# EAGLE design PC1-ISA (EAGLE 9.3.0)
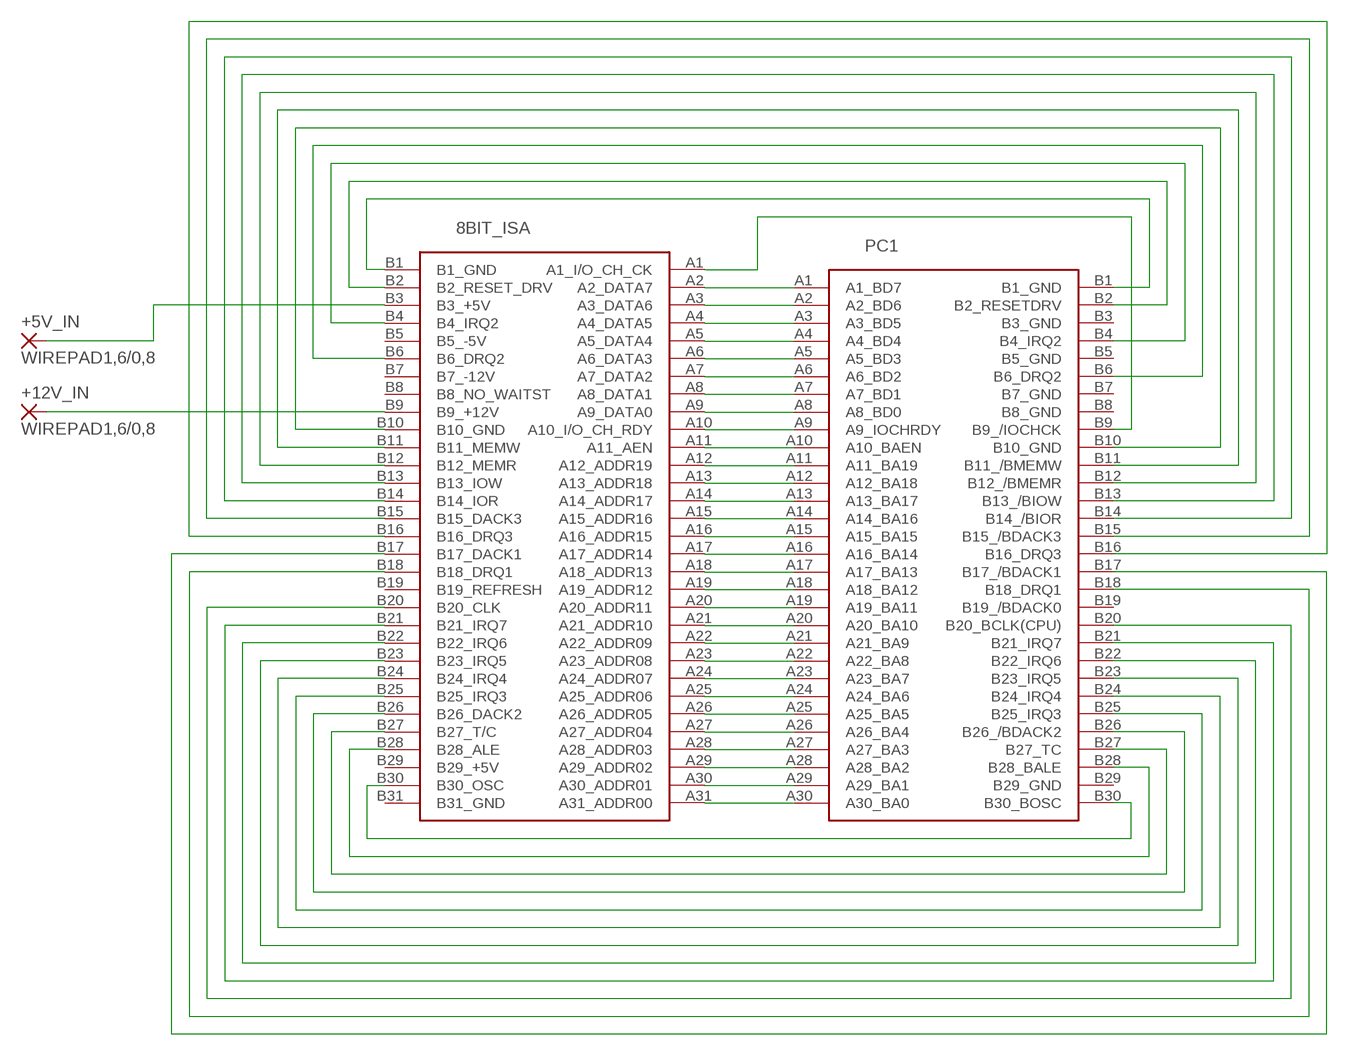
[diagram p0: schematic, sheet 1]

## Parts
8BIT_ISA  CARDEDGE_FEMALE_62PINS_8BITISA_STRAIGHT  [CARDEDGE_FEMALE_62PINS_8BITISA_STRAIGHT]
+5V_IN  WIREPAD1,6/0,8  [1,6/0,8]
+12V_IN  WIREPAD1,6/0,8  [1,6/0,8]
PC1  CARDEDGE_FEMALE_60PINS_PC1_ANGLEDLEFT  [CARDEDGE_FEMALE_60PINS_PC1_ANGLEDLEFT]

## Nets
N$1: 8BIT_ISA.A2(A2_DATA7) PC1.A1(A1_BD7)
N$2: 8BIT_ISA.A3(A3_DATA6) PC1.A2(A2_BD6)
N$3: 8BIT_ISA.A4(A4_DATA5) PC1.A3(A3_BD5)
N$4: 8BIT_ISA.A5(A5_DATA4) PC1.A4(A4_BD4)
N$5: 8BIT_ISA.A6(A6_DATA3) PC1.A5(A5_BD3)
N$6: 8BIT_ISA.A7(A7_DATA2) PC1.A6(A6_BD2)
N$7: 8BIT_ISA.A8(A8_DATA1) PC1.A7(A7_BD1)
N$8: 8BIT_ISA.A9(A9_DATA0) PC1.A8(A8_BD0)
N$9: 8BIT_ISA.A10(A10_I/O_CH_RDY) PC1.A9(A9_IOCHRDY)
N$10: 8BIT_ISA.A11(A11_AEN) PC1.A10(A10_BAEN)
N$11: 8BIT_ISA.A12(A12_ADDR19) PC1.A11(A11_BA19)
N$12: 8BIT_ISA.A13(A13_ADDR18) PC1.A12(A12_BA18)
N$13: 8BIT_ISA.A14(A14_ADDR17) PC1.A13(A13_BA17)
N$14: 8BIT_ISA.A15(A15_ADDR16) PC1.A14(A14_BA16)
N$15: 8BIT_ISA.A16(A16_ADDR15) PC1.A15(A15_BA15)
N$16: 8BIT_ISA.A17(A17_ADDR14) PC1.A16(A16_BA14)
N$17: 8BIT_ISA.A18(A18_ADDR13) PC1.A17(A17_BA13)
N$18: 8BIT_ISA.A19(A19_ADDR12) PC1.A18(A18_BA12)
N$19: 8BIT_ISA.A20(A20_ADDR11) PC1.A19(A19_BA11)
N$20: 8BIT_ISA.A21(A21_ADDR10) PC1.A20(A20_BA10)
N$21: 8BIT_ISA.A22(A22_ADDR09) PC1.A21(A21_BA9)
N$22: 8BIT_ISA.A23(A23_ADDR08) PC1.A22(A22_BA8)
N$23: 8BIT_ISA.A24(A24_ADDR07) PC1.A23(A23_BA7)
N$24: 8BIT_ISA.A25(A25_ADDR06) PC1.A24(A24_BA6)
N$25: 8BIT_ISA.A26(A26_ADDR05) PC1.A25(A25_BA5)
N$26: 8BIT_ISA.A27(A27_ADDR04) PC1.A26(A26_BA4)
N$27: 8BIT_ISA.A28(A28_ADDR03) PC1.A27(A27_BA3)
N$28: 8BIT_ISA.A29(A29_ADDR02) PC1.A28(A28_BA2)
N$29: 8BIT_ISA.A30(A30_ADDR01) PC1.A29(A29_BA1)
N$30: 8BIT_ISA.A31(A31_ADDR00) PC1.A30(A30_BA0)
N$31: 8BIT_ISA.A1(A1_I/O_CH_CK) PC1.B9(B9_/IOCHCK)
N$32: 8BIT_ISA.B1(B1_GND) PC1.B1(B1_GND)
N$33: 8BIT_ISA.B2(B2_RESET_DRV) PC1.B2(B2_RESETDRV)
N$34: 8BIT_ISA.B4(B4_IRQ2) PC1.B4(B4_IRQ2)
N$35: 8BIT_ISA.B6(B6_DRQ2) PC1.B6(B6_DRQ2)
N$36: 8BIT_ISA.B10(B10_GND) PC1.B10(B10_GND)
N$37: 8BIT_ISA.B11(B11_MEMW) PC1.B11(B11_/BMEMW)
N$38: 8BIT_ISA.B12(B12_MEMR) PC1.B12(B12_/BMEMR)
N$39: 8BIT_ISA.B30(B30_OSC) PC1.B30(B30_BOSC)
N$40: 8BIT_ISA.B28(B28_ALE) PC1.B28(B28_BALE)
N$41: 8BIT_ISA.B27(B27_T/C) PC1.B27(B27_TC)
N$42: 8BIT_ISA.B26(B26_DACK2) PC1.B26(B26_/BDACK2)
N$43: 8BIT_ISA.B25(B25_IRQ3) PC1.B25(B25_IRQ3)
N$44: 8BIT_ISA.B24(B24_IRQ4) PC1.B24(B24_IRQ4)
N$45: 8BIT_ISA.B23(B23_IRQ5) PC1.B23(B23_IRQ5)
N$46: 8BIT_ISA.B22(B22_IRQ6) PC1.B22(B22_IRQ6)
N$47: 8BIT_ISA.B21(B21_IRQ7) PC1.B21(B21_IRQ7)
N$48: 8BIT_ISA.B13(B13_IOW) PC1.B13(B13_/BIOW)
N$49: 8BIT_ISA.B14(B14_IOR) PC1.B14(B14_/BIOR)
N$50: 8BIT_ISA.B15(B15_DACK3) PC1.B15(B15_/BDACK3)
N$51: 8BIT_ISA.B16(B16_DRQ3) PC1.B16(B16_DRQ3)
N$52: 8BIT_ISA.B20(B20_CLK) PC1.B20(B20_BCLK(CPU))
N$53: 8BIT_ISA.B18(B18_DRQ1) PC1.B18(B18_DRQ1)
N$54: 8BIT_ISA.B17(B17_DACK1) PC1.B17(B17_/BDACK1)
N$55: 8BIT_ISA.B3(B3_+5V) +5V_IN.1(P)
N$56: 8BIT_ISA.B9(B9_+12V) +12V_IN.1(P)
Unconnected: 8BIT_ISA.B5(B5_-5V) 8BIT_ISA.B7(B7_-12V) 8BIT_ISA.B8(B8_NO_WAITST) 8BIT_ISA.B19(B19_REFRESH) 8BIT_ISA.B29(B29_+5V) 8BIT_ISA.B31(B31_GND) PC1.B3(B3_GND) PC1.B5(B5_GND) PC1.B7(B7_GND) PC1.B8(B8_GND) PC1.B19(B19_/BDACK0) PC1.B29(B29_GND)

## Library data of the parts
8BIT_ISA = Thomas:CARDEDGE_FEMALE_62PINS_8BITISA_STRAIGHT: 8bit ISA connector - for interfacing with an 8-bit ISA expansion card, i.e. this is the computer side. This is for a straight through-hole connector. Metal plate of the expansion card should go in the A1 and B1 end of the connector.
+5V_IN +12V_IN = wirepad:WIREPAD: Wire PAD connect wire on PCB
PC1 = Thomas:CARDEDGE_FEMALE_60PINS_PC1_ANGLEDLEFT: Commodore PC1 user port connector - for interfacing with the 60 pin "J12" card edge connector at the back of the PC1 computer. This is for an angled through-hole connector, pins pointing downwards when connected correctly to the computer.

## Board
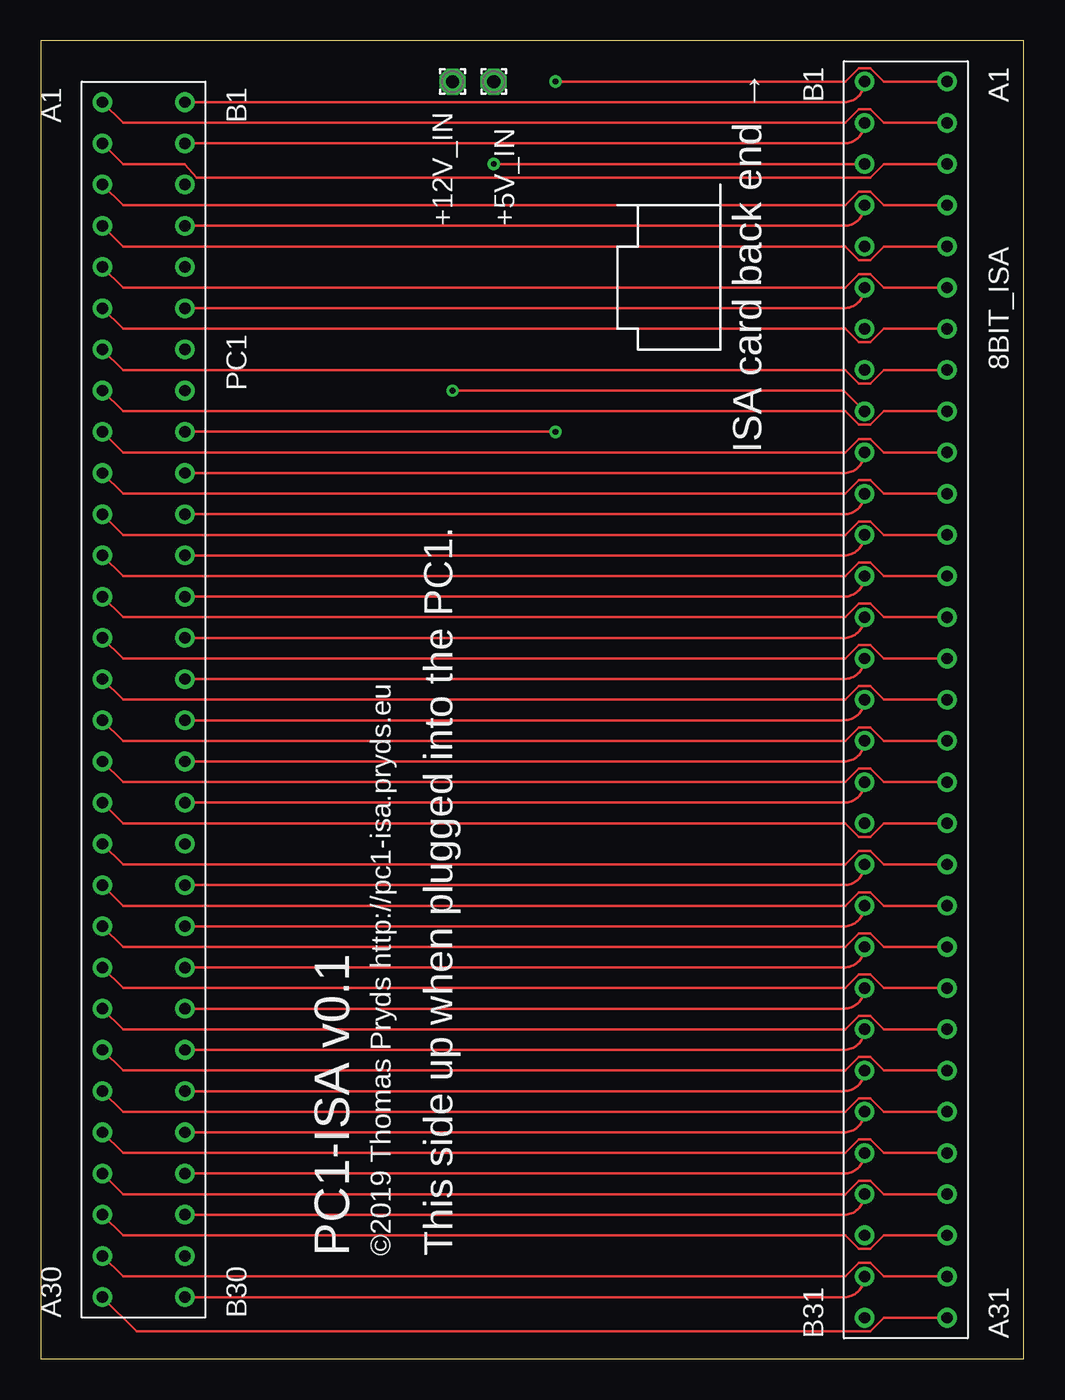
[diagram p1: board, top side]
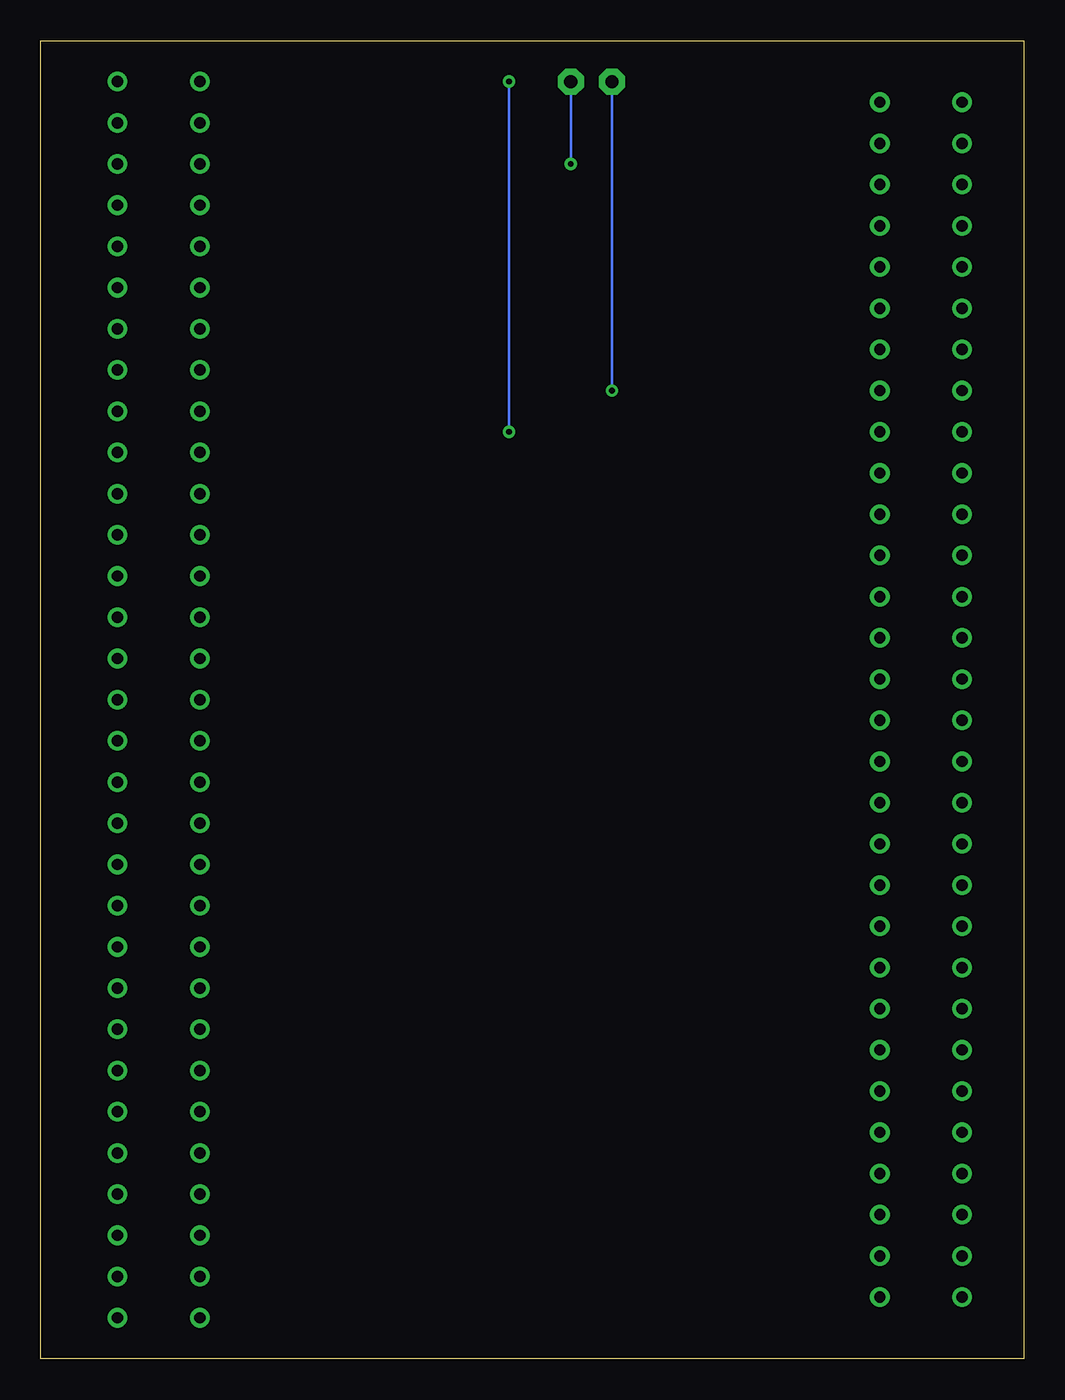
[diagram p2: board, bottom side, seen from below]

Size 60.63 x 81.27 mm. Coordinates in mm from the lower left corner, seen from the top.
Outline: 0,0 60.63,0 60.63,81.27 0,81.27 0,0
Copper layers (1*16): Top 0.035mm / dielectric 1.5mm / Bottom 0.035mm
Design rules "default": minimum track width 6mil, minimum drill 0.35mm, track to track 6mil, track to pad 6mil, pad to pad 6mil, via to via 6mil, smd to smd 6mil, copper to edge 40mil, drill to drill 6mil, minimum pad ring 10mil, minimum via ring 8mil, stop-mask expansion 4mil, vias tented up to drill 0mil, thermal gap 10mil

### Footprints (pad centres in the part's own frame; a part is rotated, then mirrored left to right if it is on the bottom)
CARDEDGE_FEMALE_62PINS_8BITISA_STRAIGHT = drill 0.7: A1 7.62,-1.27; A2 7.62,-3.81; A3 7.62,-6.35; A4 7.62,-8.89; A5 7.62,-11.43; A6 7.62,-13.97; A7 7.62,-16.51; A8 7.62,-19.05; A9 7.62,-21.59; A10 7.62,-24.13; A11 7.62,-26.67; A12 7.62,-29.21; A13 7.62,-31.75; A14 7.62,-34.29; A15 7.62,-36.83; A16 7.62,-39.37; A17 7.62,-41.91; A18 7.62,-44.45; A19 7.62,-46.99; A20 7.62,-49.53; A21 7.62,-52.07; A22 7.62,-54.61; A23 7.62,-57.15; A24 7.62,-59.69; A25 7.62,-62.23; A26 7.62,-64.77; A27 7.62,-67.31; A28 7.62,-69.85; A29 7.62,-72.39; A30 7.62,-74.93; A31 7.62,-77.47; B1 2.54,-1.27; B2 2.54,-3.81; B3 2.54,-6.35; B4 2.54,-8.89; B5 2.54,-11.43; B6 2.54,-13.97; B7 2.54,-16.51; B8 2.54,-19.05; B9 2.54,-21.59; B10 2.54,-24.13; B11 2.54,-26.67; B12 2.54,-29.21; B13 2.54,-31.75; B14 2.54,-34.29; B15 2.54,-36.83; B16 2.54,-39.37; B17 2.54,-41.91; B18 2.54,-44.45; B19 2.54,-46.99; B20 2.54,-49.53; B21 2.54,-52.07; B22 2.54,-54.61; B23 2.54,-57.15; B24 2.54,-59.69; B25 2.54,-62.23; B26 2.54,-64.77; B27 2.54,-67.31; B28 2.54,-69.85; B29 2.54,-72.39; B30 2.54,-74.93; B31 2.54,-77.47
1,6/0,8 = drill 0.813 pad 1.6 octagon: 1 0,0
CARDEDGE_FEMALE_60PINS_PC1_ANGLEDLEFT = drill 0.7: A1 2.54,-1.27; A2 2.54,-3.81; A3 2.54,-6.35; A4 2.54,-8.89; A5 2.54,-11.43; A6 2.54,-13.97; A7 2.54,-16.51; A8 2.54,-19.05; A9 2.54,-21.59; A10 2.54,-24.13; A11 2.54,-26.67; A12 2.54,-29.21; A13 2.54,-31.75; A14 2.54,-34.29; A15 2.54,-36.83; A16 2.54,-39.37; A17 2.54,-41.91; A18 2.54,-44.45; A19 2.54,-46.99; A20 2.54,-49.53; A21 2.54,-52.07; A22 2.54,-54.61; A23 2.54,-57.15; A24 2.54,-59.69; A25 2.54,-62.23; A26 2.54,-64.77; A27 2.54,-67.31; A28 2.54,-69.85; A29 2.54,-72.39; A30 2.54,-74.93; B1 7.62,-1.27; B2 7.62,-3.81; B3 7.62,-6.35; B4 7.62,-8.89; B5 7.62,-11.43; B6 7.62,-13.97; B7 7.62,-16.51; B8 7.62,-19.05; B9 7.62,-21.59; B10 7.62,-24.13; B11 7.62,-26.67; B12 7.62,-29.21; B13 7.62,-31.75; B14 7.62,-34.29; B15 7.62,-36.83; B16 7.62,-39.37; B17 7.62,-41.91; B18 7.62,-44.45; B19 7.62,-46.99; B20 7.62,-49.53; B21 7.62,-52.07; B22 7.62,-54.61; B23 7.62,-57.15; B24 7.62,-59.69; B25 7.62,-62.23; B26 7.62,-64.77; B27 7.62,-67.31; B28 7.62,-69.85; B29 7.62,-72.39; B30 7.62,-74.93

### Placement (x,y rotation side)
8BIT_ISA  48.26,80.01 0 top
+5V_IN  27.94,78.74 270 top
+12V_IN  25.4,78.74 90 top
PC1  1.27,78.74 0 top

### Tracks (layer width: path | path; a pad name or v marks a point on that pad's centre or on a via)
N$1
  Top 0.152: PC1.A1 5.08,76.2 49.62,76.2 50.45,77.03 51.15,77.03 51.98,76.2 8BIT_ISA.A2
N$2
  Top 0.152: PC1.A2 5.08,73.66 8.89,73.66 9.63,72.83 51.15,72.83 51.98,73.66 8BIT_ISA.A3
N$3
  Top 0.152: PC1.A3 5.08,71.12 49.62,71.12 50.45,71.95 51.15,71.95 51.98,71.12 8BIT_ISA.A4
N$4
  Top 0.152: PC1.A4 5.08,68.58 49.62,68.58 50.45,67.75 51.15,67.75 51.98,68.58 8BIT_ISA.A5
N$5
  Top 0.152: PC1.A5 5.08,66.04 49.62,66.04 50.45,66.87 51.15,66.87 51.98,66.04 8BIT_ISA.A6
N$6
  Top 0.152: PC1.A6 5.08,63.5 49.62,63.5 50.45,62.67 51.15,62.67 51.98,63.5 8BIT_ISA.A7
N$7
  Top 0.152: PC1.A7 5.08,60.96 49.62,60.96 50.45,60.13 51.15,60.13 51.98,60.96 8BIT_ISA.A8
N$8
  Top 0.152: PC1.A8 5.08,58.42 49.62,58.42 50.45,57.59 51.15,57.59 51.98,58.42 8BIT_ISA.A9
N$9
  Top 0.152: PC1.A9 5.08,55.88 49.62,55.88 50.45,56.71 51.15,56.71 51.98,55.88 8BIT_ISA.A10
N$10
  Top 0.152: PC1.A10 5.08,53.34 49.62,53.34 50.45,54.17 51.15,54.17 51.98,53.34 8BIT_ISA.A11
N$11
  Top 0.152: PC1.A11 5.08,50.8 49.62,50.8 50.45,51.63 51.15,51.63 51.98,50.8 8BIT_ISA.A12
N$12
  Top 0.152: PC1.A12 5.08,48.26 49.62,48.26 50.45,49.09 51.15,49.09 51.98,48.26 8BIT_ISA.A13
N$13
  Top 0.152: PC1.A13 5.08,45.72 49.62,45.72 50.45,46.55 51.15,46.55 51.98,45.72 8BIT_ISA.A14
N$14
  Top 0.152: PC1.A14 5.08,43.18 49.62,43.18 50.45,44.01 51.15,44.01 51.98,43.18 8BIT_ISA.A15
N$15
  Top 0.152: PC1.A15 5.08,40.64 49.62,40.64 50.45,41.47 51.15,41.47 51.98,40.64 8BIT_ISA.A16
N$16
  Top 0.152: PC1.A16 5.08,38.1 49.62,38.1 50.45,38.93 51.15,38.93 51.98,38.1 8BIT_ISA.A17
N$17
  Top 0.152: PC1.A17 5.08,35.56 49.62,35.56 50.45,36.39 51.15,36.39 51.98,35.56 8BIT_ISA.A18
N$18
  Top 0.152: PC1.A18 5.08,33.02 49.62,33.02 50.45,32.19 51.15,32.19 51.98,33.02 8BIT_ISA.A19
N$19
  Top 0.152: PC1.A19 5.08,30.48 49.62,30.48 50.45,31.31 51.15,31.31 51.98,30.48 8BIT_ISA.A20
N$20
  Top 0.152: PC1.A20 5.08,27.94 49.62,27.94 50.45,28.77 51.15,28.77 51.98,27.94 8BIT_ISA.A21
N$21
  Top 0.152: PC1.A21 5.08,25.4 49.62,25.4 50.45,26.23 51.15,26.23 51.98,25.4 8BIT_ISA.A22
N$22
  Top 0.152: PC1.A22 5.08,22.86 49.62,22.86 50.45,23.69 51.15,23.69 51.98,22.86 8BIT_ISA.A23
N$23
  Top 0.152: PC1.A23 5.08,20.32 49.62,20.32 50.45,21.15 51.15,21.15 51.98,20.32 8BIT_ISA.A24
N$24
  Top 0.152: PC1.A24 5.08,17.78 49.62,17.78 50.45,18.61 51.15,18.61 51.98,17.78 8BIT_ISA.A25
N$25
  Top 0.152: PC1.A25 5.08,15.24 49.62,15.24 50.45,16.07 51.15,16.07 51.98,15.24 8BIT_ISA.A26
N$26
  Top 0.152: PC1.A26 5.08,12.7 49.62,12.7 50.45,13.53 51.15,13.53 51.98,12.7 8BIT_ISA.A27
N$27
  Top 0.152: PC1.A27 5.08,10.16 49.62,10.16 50.45,10.99 51.15,10.99 51.98,10.16 8BIT_ISA.A28
N$28
  Top 0.152: PC1.A28 5.08,7.62 49.62,7.62 50.45,6.79 51.15,6.79 51.98,7.62 8BIT_ISA.A29
N$29
  Top 0.152: PC1.A29 5.08,5.08 49.62,5.08 50.45,5.91 51.15,5.91 51.98,5.08 8BIT_ISA.A30
N$30
  Top 0.152: 8BIT_ISA.A31 51.98,2.54 51.15,1.71 5.91,1.71 PC1.A30
N$31  (via drill 0.35)
  Top 0.152: PC1.B9 v31.75,57.15 | 8BIT_ISA.A1 51.98,78.74 51.15,79.57 50.45,79.57 49.62,78.74 v31.75,78.74
  Bottom 0.152: v31.75,57.15 v31.75,78.74
N$32
  Top 0.152: PC1.B1 49.53,77.47 arc90 8BIT_ISA.B1
N$33
  Top 0.152: PC1.B2 49.53,74.93 arc90 8BIT_ISA.B2
N$34
  Top 0.152: PC1.B4 49.53,69.85 arc90 8BIT_ISA.B4
N$35
  Top 0.152: PC1.B6 49.53,64.77 arc90 8BIT_ISA.B6
N$36
  Top 0.152: PC1.B10 49.53,54.61 arc90 8BIT_ISA.B10
N$37
  Top 0.152: PC1.B11 49.53,52.07 arc90 8BIT_ISA.B11
N$38
  Top 0.152: PC1.B12 49.53,49.53 arc90 8BIT_ISA.B12
N$39
  Top 0.152: PC1.B30 49.53,3.81 arc90 8BIT_ISA.B30
N$40
  Top 0.152: PC1.B28 49.53,8.89 arc90 8BIT_ISA.B28
N$41
  Top 0.152: PC1.B27 49.53,11.43 arc90 8BIT_ISA.B27
N$42
  Top 0.152: PC1.B26 49.53,13.97 arc90 8BIT_ISA.B26
N$43
  Top 0.152: PC1.B25 49.53,16.51 arc90 8BIT_ISA.B25
N$44
  Top 0.152: PC1.B24 49.53,19.05 arc90 8BIT_ISA.B24
N$45
  Top 0.152: PC1.B23 49.53,21.59 arc90 8BIT_ISA.B23
N$46
  Top 0.152: PC1.B22 49.53,24.13 arc90 8BIT_ISA.B22
N$47
  Top 0.152: PC1.B21 49.53,26.67 arc90 8BIT_ISA.B21
N$48
  Top 0.152: PC1.B13 49.53,46.99 arc90 8BIT_ISA.B13
N$49
  Top 0.152: PC1.B14 49.53,44.45 arc90 8BIT_ISA.B14
N$50
  Top 0.152: PC1.B15 49.53,41.91 arc90 8BIT_ISA.B15
N$51
  Top 0.152: PC1.B16 49.53,39.37 arc90 8BIT_ISA.B16
N$52
  Top 0.152: PC1.B20 49.53,29.21 arc90 8BIT_ISA.B20
N$53
  Top 0.152: PC1.B18 49.53,34.29 arc90 8BIT_ISA.B18
N$54
  Top 0.152: PC1.B17 49.53,36.83 arc90 8BIT_ISA.B17
N$55  (via drill 0.35)
  Top 0.152: v27.94,73.66 8BIT_ISA.B3
  Bottom 0.152: +5V_IN.1 v27.94,73.66
N$56  (via drill 0.35)
  Top 0.152: v25.4,59.69 49.53,59.69 8BIT_ISA.B9
  Bottom 0.152: +12V_IN.1 v25.4,59.69

### Text on the board
tPlace: ISA card back end → | PC1-ISA v0.1 | ©2019 Thomas Pryds http://pc1-isa.pryds.eu | This side up when plugged into the PC1.